# Altium schematic sheet power.SchDoc
size A4; DocumentNumber: 3; SheetNumber: 3; SheetTotal: 9
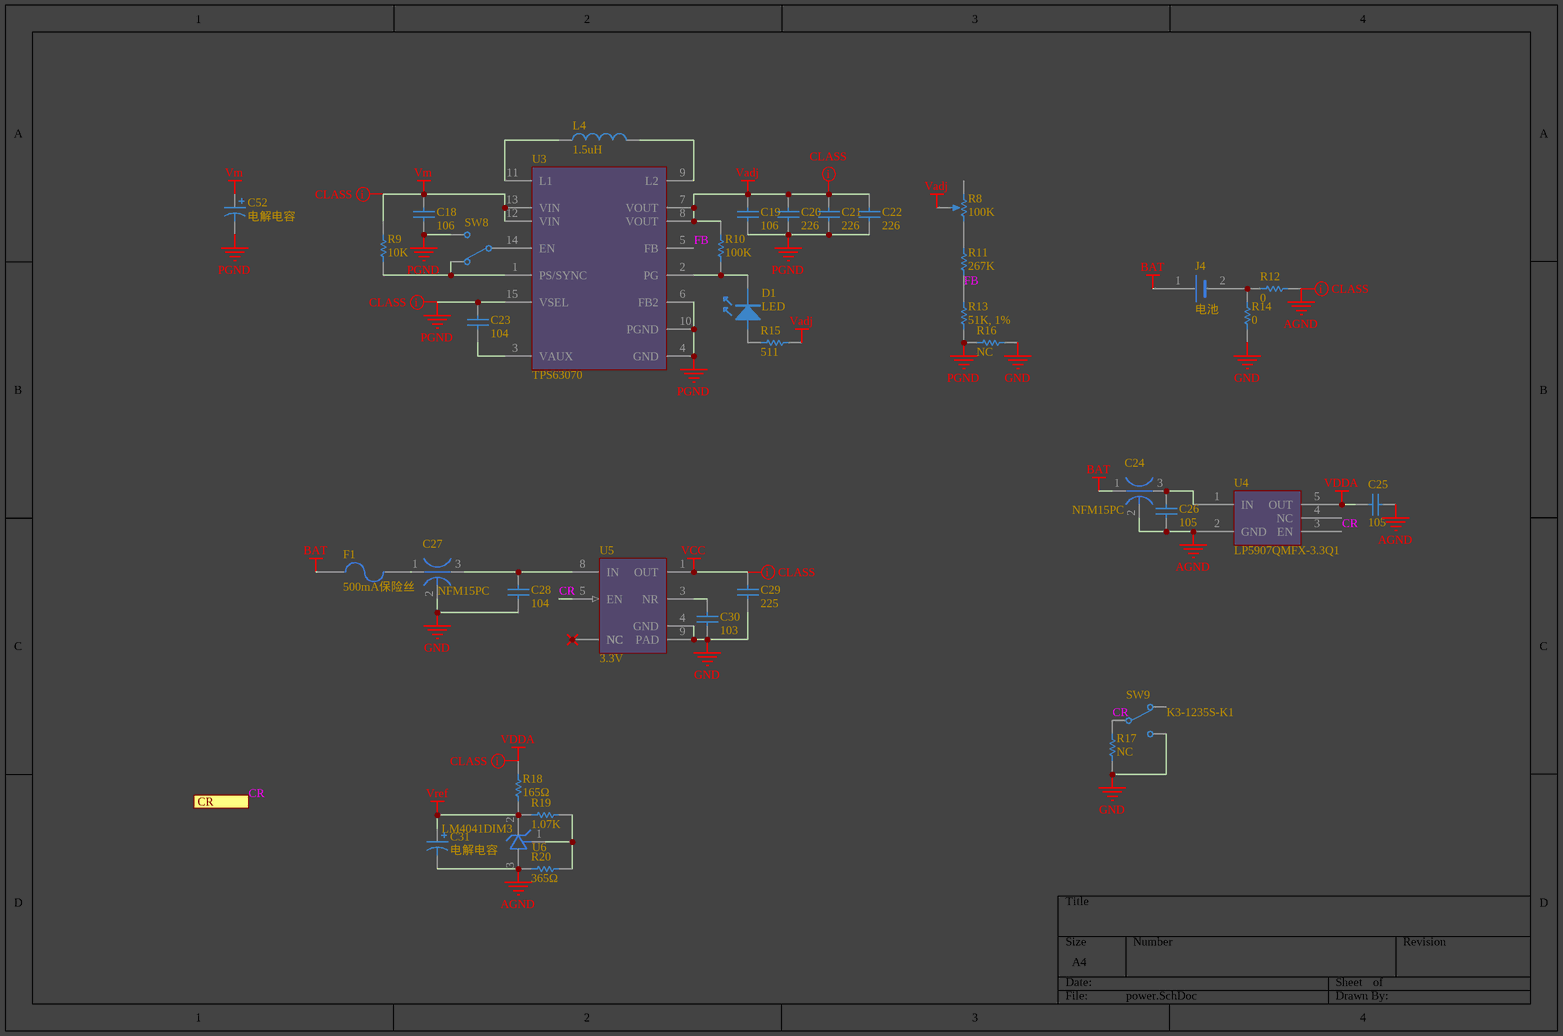
[diagram p0: power.SchDoc]

## Parts
C18  106  [C0603]
C19  106  [C0603]
C20  226  [0805C]
C21  226  [0805C]
C22  226  [0805C]
C23  104  [C0402]
C24  NFM15PC  [FILTER-SMD_3P-L1.0-W0.5-L]
C25  105  [C0603]
C26  105  [C0603]
C27  NFM15PC  [FILTER-SMD_3P-L1.0-W0.5-L]
C28  104  [C0402]
C29  225  [C0603]
C30  103  [C0402]
C31  电解电容  [3216-ce]
C52  电解电容  [贴片电解 6.3*5.4]
D1  LED  [LED 0603R]
F1  500mA保险丝  [FUSE-1210]
J4  电池  [MX2.0]
L4  1.5uH  [L5X5]
R8  100K  [3296W]
R9  10K  [R0402]
R10  100K  [R0402]
R11  267K  [R0402]
R12  0  [R0603]
R13  51K, 1%  [R0402]
R14  0  [R0603]
R15  511  [R0402]
R16  NC  [R0603]
R17  NC  [R0603]
R18  165Ω  [R0402]
R19  1.07K  [R0402]
R20  365Ω  [R0402]
SW8  K3-1235S-K1  [K3-1235S-K1]  (value not drawn)
SW9  K3-1235S-K1  [K3-1235S-K1]
U3  TPS63070  [VQFN-15]
U4  LP5907QMFX-3.3Q1  [SOT-23-5]
U5  3.3V  [VSON-8]
U6  LM4041DIM3  [SOT-23]

## Ports
CR (in)

## Nets
AGND: C24.2(GND) C25.1 C26.1 C31.2 R12.1 R20.2 U4.2(GND) U6.3(A)
BAT: C24.1(IN) F1.1 J4.1(+)
GND: C27.2(GND) C28.1 C29.1 C30.1 R14.1 R16.1 R17.2 SW9.3 U5.4(GND) U5.9(PAD)
PGND: C18.2 C19.1 C20.1 C21.1 C22.1 C23.2 C52.2 R13.2 R16.2 SW8.3 U3.4(GND) U3.6(FB2) U3.10(PGND) U3.15(VSEL)
Vadj: C19.2 C20.2 C21.2 C22.2 R8.2(TAP) R10.2 R15.1 U3.7(VOUT) U3.8(VOUT)
VCC: C29.2 U5.1(OUT)
VDDA: C25.2 R18.2 U4.5(OUT)
Vm: C18.1 C52.1 R9.1 U3.12(VIN) U3.13(VIN)
Vref: C31.1 R18.1 R19.2 U6.2(K)
CR: R17.1 SW9.2 U4.3(EN) U5.5(EN) ; port CR
FB: R11.2 R13.1 U3.5(FB)
NetC23_1: C23.1 U3.3(VAUX)
NetC24_3: C24.3(OUT) C26.2 U4.1(IN)
NetC27_1: C27.1(IN) F1.2
NetC27_3: C27.3(OUT) C28.2 U5.8(IN)
NetC30_2: C30.2 U5.3(NR)
NetD1_A: D1.A R15.2
NetD1_K: D1.K R10.1 U3.2(PG)
NetJ4_2: J4.2(-) R12.2 R14.2
NetL4_1: L4.1 U3.11(L1)
NetL4_2: L4.2 U3.9(L2)
NetR8_3: R8.3(BOT) R11.1
NetR9_2: R9.2 SW8.1 U3.1(PS/SYNC)
NetR19_1: R19.1 R20.1 U6.1(R)
NetSW8_2: SW8.2 U3.14(EN)
NetU5_2: U5.2(NC) U5.6(NC) U5.7(NC)

Not connected (* = marked no-connect by the designer): R8 1(TOP); SW9 1; U4 4(NC)

## Layout directives
net class GND: AGND, PGND
net class POW: Vadj, VCC, VDDA, Vm

## Library data of the parts
C18-C23 C25 C26 C28-C30 = 电容: Capacitor; Value: 22pF; Published: 8-Jun-2000; LatestRevisionDate: 17-Jul-2002; LatestRevisionNote: Re-released for DXP Platform.; PackageReference: RAD-0.3; Publisher: Altium Limited; PackageDescription: Radial Cap, Thru-Hole; 2 Leads; 0.3 in Pin Spacing
C24 C27 = 陶瓷滤波器: BOM_Manufacturer: Murata Electronics; BOM_Manufacturer Part: NFM15PC473C1C3D; Capacitance: 47nF; Contributor: LCSC; BOM_Supplier: LCSC; BOM_Supplier Part: C162672; spicePre: U; spiceSymbolName: NFM15PC473C1C3D
C31 C52 = 电解电容: Polarized Capacitor (Axial); Value: 100pF; Published: 8-Jun-2000; LatestRevisionDate: 17-Jul-2002; LatestRevisionNote: Re-released for DXP Platform.; PackageReference: POLAR0.8; Publisher: Altium Limited; PackageDescription: Polarized Capacitor; 2 Leads
F1 = 保险丝: 500mA保险丝  1210; Published: 8-Jun-2000; LatestRevisionDate: 17-Jul-2002; LatestRevisionNote: Re-released for DXP Platform.; PackageReference: PIN-W2/E2.8; Publisher: Altium Limited; PackageDescription: Thru-Hole; 2 Leads
L4 = 电感
R8 = 电位器
R9-R20 = 电阻: Resistor; Value: 150R; Published: 8-Jun-2000; LatestRevisionDate: 17-Jul-2002; LatestRevisionNote: Re-released for DXP Platform.; PackageReference: AXIAL-0.3; Publisher: Altium Limited; PackageDescription: Axial Device, Thru-Hole; 2 Leads; 0.3 in Pin Spacing
SW8 SW9 = 单刀双掷: Switch
U4 = 线性稳压-5脚
U5 = TPS73512DRBR: No Description Available; Alternate_PartNumber: TPS73512DRBT; Manufacturer: Texas Instruments; CompType: IC; PIN_COUNT: 9; Application_BuildNumber: *; PartNumber: TPS73512DRBR; PackageReference: DRB0008A; MountType: SMT; RoHS: Y; RefDes: RefDes; Type: DEV; Value: Value; Copyright: Copyright (C) 2018 Accelerated Designs. All rights reserved
U6 = 电压基准: BOM_Manufacturer: PJ(Pingjingsemi); BOM_Manufacturer Part: TL431; Contributor: LCSC; SMT Type: Extend; BOM_Supplier: LCSC; BOM_Supplier Part: C411752; BOM_LCSC Assembly: Yes; spicePre: U; spiceSymbolName: TL431_C411752